# Altium schematic sheet MainBoard.SchDoc: iTFLS Card Reader - MainBoard
size A3; Author: Boyang H. Han (yqszxx); PageSetup: Record=PageOptions|CenterHorizontal=True|CenterVertical=True|PrintScale=1.00|XCorrection=1.00|YCorrection=1.00|PrintKind=0|BorderSize=5000000|LeftOffset=0|BottomOffset=0|Orientation=2|PaperLength=2969|PaperWidth=2100|Scale=100|PaperSource=7|PrintQuality=300|MediaType=1|DitherType=10|PrintScaleMode=1|PaperKind=A4|PaperIndex=9
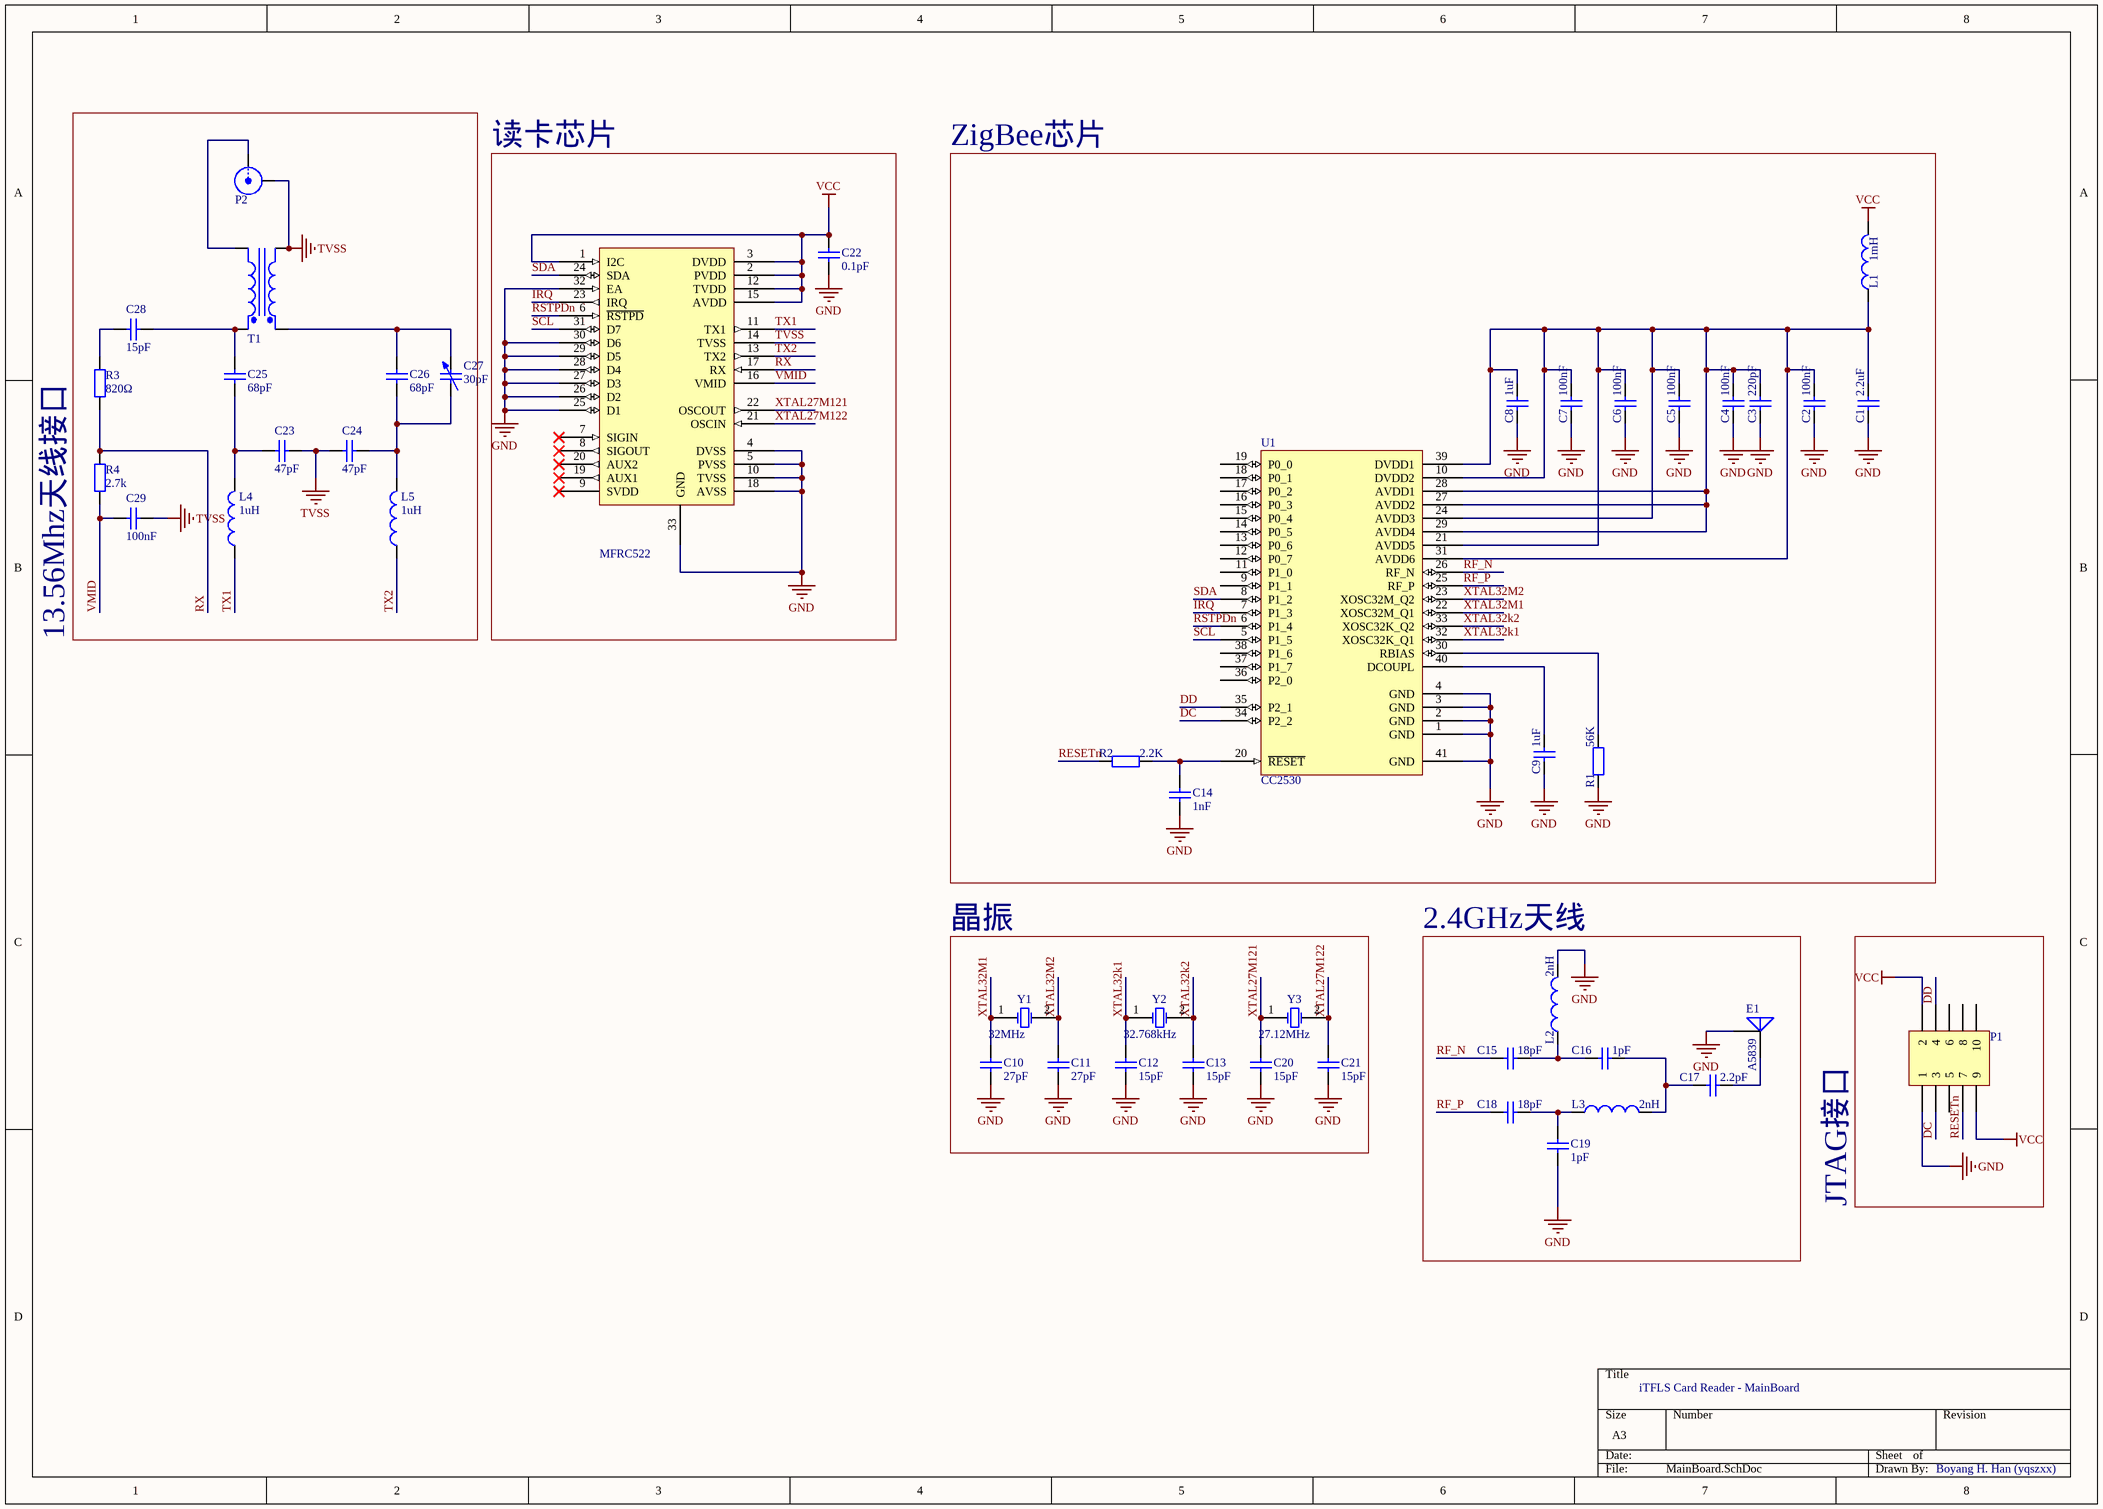
[diagram p0: MainBoard.SchDoc]

## Parts
C1  value 2.2uF  [0603]  (hidden comment: Cap)
C2  value 100nF  [0603]  (hidden comment: Cap)
C3  value 220pF  [0603]  (hidden comment: Cap)
C4  value 100nF  [0603]  (hidden comment: Cap)
C5  value 100nF  [0603]  (hidden comment: Cap)
C6  value 100nF  [0603]  (hidden comment: Cap)
C7  value 100nF  [0603]  (hidden comment: Cap)
C8  value 1uF  [0603]  (hidden comment: Cap)
C9  value 1uF  [0603]  (hidden comment: Cap)
C10  value 27pF  [0603]  (hidden comment: Cap)
C11  value 27pF  [0603]  (hidden comment: Cap)
C12  value 15pF  [0603]  (hidden comment: Cap)
C13  value 15pF  [0603]  (hidden comment: Cap)
C14  value 1nF  [0603]  (hidden comment: Cap)
C15  value 18pF  [0603]  (hidden comment: Cap)
C16  value 1pF  [0603]  (hidden comment: Cap)
C17  value 2.2pF  [0603]  (hidden comment: Cap)
C18  value 18pF  [0603]  (hidden comment: Cap)
C19  value 1pF  [0603]  (hidden comment: Cap)
C20  value 15pF  [0603]  (hidden comment: Cap)
C21  value 15pF  [0603]  (hidden comment: Cap)
C22  value 0.1pF  [0603]  (hidden comment: Cap)
C23  value 47pF  [0603]  (hidden comment: Cap)
C24  value 47pF  [0603]  (hidden comment: Cap)
C25  value 68pF  [0603]  (hidden comment: Cap)
C26  value 68pF  [0603]  (hidden comment: Cap)
C27  value 30pF  [4x4VC]  (hidden comment: Cap Var)
C28  value 15pF  [0603]  (hidden comment: Cap)
C29  value 100nF  [0603]  (hidden comment: Cap)
E1  A5839  [A5839]
L1  value 1mH  [0603]  (hidden comment: Inductor)
L2  value 2nH  [0603]  (hidden comment: Inductor)
L3  value 2nH  [0603]  (hidden comment: Inductor)
L4  value 1uH  [0603]  (hidden comment: Inductor)
L5  value 1uH  [0603]  (hidden comment: Inductor)
P1  Header 5X2  [HDR2X5]  (value not drawn)
P2  U.FL  [U.FL]  (value not drawn)
R1  value 56K  [0603]  (hidden comment: Res2)
R2  value 2.2K  [0603]  (hidden comment: Res2)
R3  value 820Ω  [0603]  (hidden comment: Res2)
R4  value 2.7k  [0603]  (hidden comment: Res2)
T1  1812WBT-3  [1812WBT-3]  (value not drawn)
U1  CC2530  [QFN40]
U2  MFRC522  [QFN32]
Y1  value 32MHz  [XTAL3225]  (hidden comment: XTAL)
Y2  value 32.768kHz  [XTAL3215]  (hidden comment: XTAL)
Y3  value 27.12MHz  [XTAL3225]  (hidden comment: XTAL)

## Blocks framed on the sheet
13.56Mhz天线接口: C23-C29 L4 L5 P2 R3 R4 T1
读卡芯片: C22 U2
ZigBee芯片: C1-C9 C14 L1 R1 R2 U1
晶振: C10-C13 C20 C21 Y1-Y3
2.4GHz天线: C15-C19 E1 L2 L3
JTAG接口: P1

## Nets
GND: C1.1 C2.1 C3.1 C4.1 C5.1 C6.1 C7.1 C8.1 C9.1 C10.1 C11.1 C12.1 C13.1 C14.1 C19.1 C20.1 C21.1 C22.1 E1.2(GND) L2.2 P1.1 R1.1 U1.1(GND) U1.2(GND) U1.3(GND) U1.4(GND) U1.41(GND) U2.4(DVSS) U2.5(PVSS) U2.10(TVSS) U2.18(AVSS) U2.25(D1) U2.26(D2) U2.27(D3) U2.28(D4) U2.29(D5) U2.30(D6) U2.32(EA) U2.33(GND)
TVSS: C23.1 C24.2 C29.1 P2.2(Y) T1.2(Pri-) U2.14(TVSS)
VCC: C22.2 L1.2 P1.2 P1.9 U2.1(I2C) U2.2(PVDD) U2.3(DVDD) U2.12(TVDD) U2.15(AVDD)
DC: P1.3 U1.34(P2_2)
DD: P1.4 U1.35(P2_1)
IRQ: U1.7(P1_3) U2.23(IRQ)
RESETn: P1.7 R2.1
RF_N: C15.1 U1.26(RF_N)
RF_P: C18.1 U1.25(RF_P)
RSTPDn: U1.6(P1_4) U2.6(~{RSTPD})
RX: R3.1 R4.2 U2.17(RX)
SCL: U1.5(P1_5) U2.31(D7)
SDA: U1.8(P1_2) U2.24(SDA)
TX1: L4.1 U2.11(TX1)
TX2: L5.1 U2.13(TX2)
VMID: C29.2 R4.1 U2.16(VMID)
XTAL27M121: C20.2 U2.22(OSCOUT) Y3.1(OSC1)
XTAL27M122: C21.2 U2.21(OSCIN) Y3.2(OSC2)
XTAL32k1: C12.2 U1.32(XOSC32K_Q1) Y2.1(OSC1)
XTAL32k2: C13.2 U1.33(XOSC32K_Q2) Y2.2(OSC2)
XTAL32M1: C10.2 U1.22(XOSC32M_Q1) Y1.1(OSC1)
XTAL32M2: C11.2 U1.23(XOSC32M_Q2) Y1.2(OSC2)
NetC1_2: C1.2 C2.2 C3.2 C4.2 C5.2 C6.2 C7.2 C8.2 L1.1 U1.10(DVDD2) U1.21(AVDD5) U1.24(AVDD3) U1.27(AVDD2) U1.28(AVDD1) U1.29(AVDD4) U1.31(AVDD6) U1.39(DVDD1)
NetC9_2: C9.2 U1.40(DCOUPL)
NetC14_2: C14.2 R2.2 U1.20(~{RESET})
NetC15_2: C15.2 C16.1 L2.1
NetC16_2: C16.2 C17.1 L3.2
NetC17_2: C17.2 E1.1(FEED)
NetC18_2: C18.2 C19.2 L3.1
NetC23_2: C23.2 C25.1 L4.2
NetC24_1: C24.1 C26.1 C27.1 L5.2
NetC25_2: C25.2 C28.1 T1.4(Sec+)
NetC26_2: C26.2 C27.2 T1.1(Pri+)
NetC28_2: C28.2 R3.2
NetP2_1: P2.1(X) T1.3(Sec-)
NetR1_2: R1.2 U1.30(RBIAS)

Not connected (* = marked no-connect by the designer): P1 5 6 8 10; U1 9(P1_1) 11(P1_0) 12(P0_7) 13(P0_6) 14(P0_5) 15(P0_4) 16(P0_3) 17(P0_2) 18(P0_1) 19(P0_0) 36(P2_0) 37(P1_7) 38(P1_6); U2 7(SIGIN)* 8(SIGOUT)* 9(SVDD)* 19(AUX1)* 20(AUX2)*

## Library data of the parts
C1-C26 C28 C29 = Cap: Capacitor; Published: 8-Jun-2000; LatestRevisionDate: 17-Jul-2002; LatestRevisionNote: Re-released for DXP Platform.; PackageReference: RAD-0.3; Publisher: Altium Limited; PackageDescription: Radial Cap, Thru-Hole; 2 Leads; 0.3 in Pin Spacing
C27 = Cap Var: Variable or Adjustable Capacitor; Published: 24-Mar-1999; LatestRevisionDate: 29-May-2009; LatestRevisionNote: IPC-7351 Footprint Added.; PackageReference: C1210; Publisher: Altium Limited; PackageDescription: Chip Capacitor 1210 Case Size; Code_JEITA: 1210; Code_IPC: CAPC3225
L1-L5 = Inductor: Code_IEC: 1005; Published: 8-Jun-2000; LatestRevisionDate: 29-May-2009; LatestRevisionNote: IPC-7351 Footprint Added.; PackageReference: 0402-A; Publisher: Altium Limited; PackageDescription: Chip Inductor; Code_JEITA: 0402
P1 = Header 5X2: Header, 5-Pin, Dual row; LatestRevisionDate: 17-Jul-2002; LatestRevisionNote: Re-released for DXP Platform.; Publisher: Altium Limited
P2 = SMB: SMB Straight Connector; LatestRevisionDate: 17-Jul-2002; LatestRevisionNote: Re-released for DXP Platform.; Publisher: Altium Limited
R1-R4 = Res2: Resistor; Published: 8-Jun-2000; LatestRevisionDate: 17-Jul-2002; LatestRevisionNote: Re-released for DXP Platform.; PackageReference: AXIAL-0.4; Publisher: Altium Limited; PackageDescription: Axial Device, Thru-Hole; 2 Leads; 0.4 in Pin Spacing
Y1-Y3 = XTAL: Crystal Oscillator; Published: 8-Jun-2000; LatestRevisionDate: 17-Jul-2002; LatestRevisionNote: Re-released for DXP Platform.; PackageReference: R38; Publisher: Altium Limited; PackageDescription: Crystal, Thru-Hole; 2 Leads; Body 3.1 x 8.2 mm (Dia.xH)